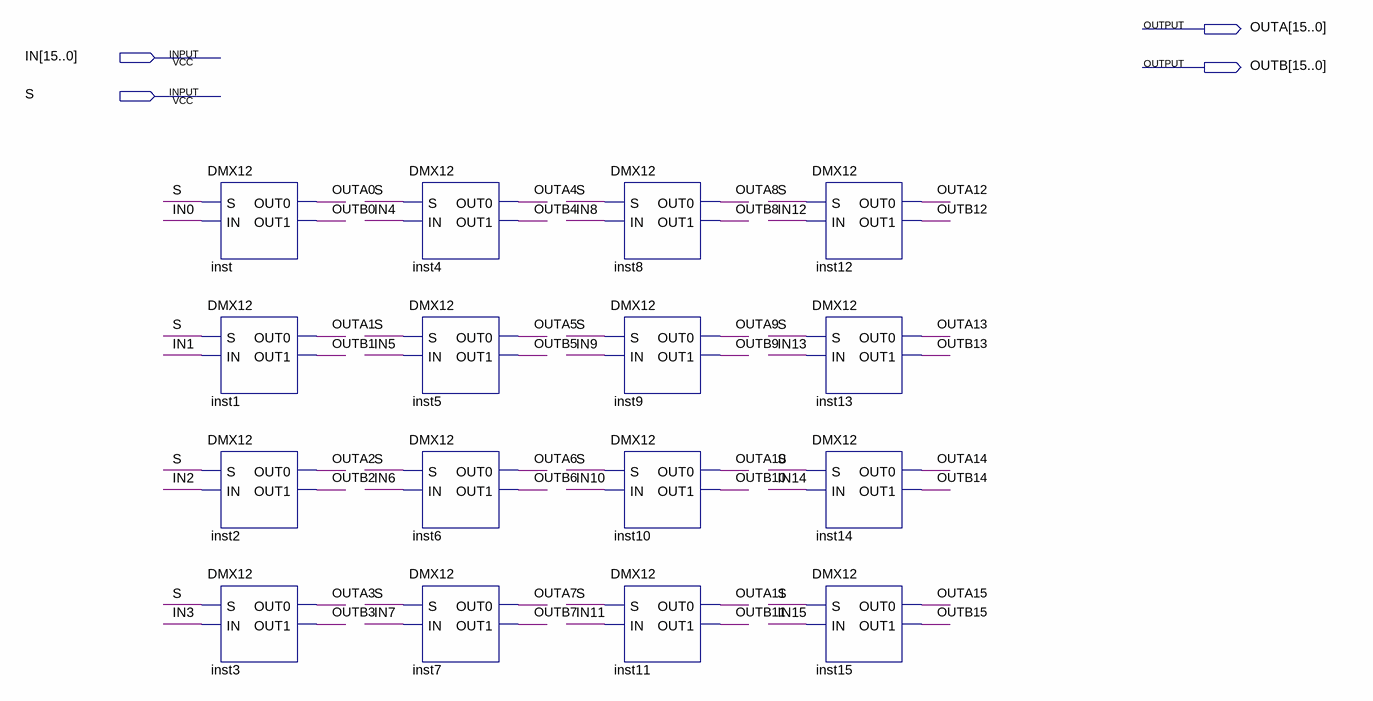
[diagram p0: schematic sheet]
// Quartus schematic DMX16.bdf as structural Verilog: 16 symbols, 4 pins
module DMX16 (
  input  [15:0] IN,
  input  S,
  output [15:0] OUTA,
  output [15:0] OUTB
);

  DMX12 inst (.S(S), .IN(IN[0]), .OUT0(OUTA[0]), .OUT1(OUTB[0]));
  DMX12 inst1 (.S(S), .IN(IN[1]), .OUT0(OUTA[1]), .OUT1(OUTB[1]));
  DMX12 inst2 (.S(S), .IN(IN[2]), .OUT0(OUTA[2]), .OUT1(OUTB[2]));
  DMX12 inst3 (.S(S), .IN(IN[3]), .OUT0(OUTA[3]), .OUT1(OUTB[3]));
  DMX12 inst4 (.S(S), .IN(IN[4]), .OUT0(OUTA[4]), .OUT1(OUTB[4]));
  DMX12 inst5 (.S(S), .IN(IN[5]), .OUT0(OUTA[5]), .OUT1(OUTB[5]));
  DMX12 inst6 (.S(S), .IN(IN[6]), .OUT0(OUTA[6]), .OUT1(OUTB[6]));
  DMX12 inst7 (.S(S), .IN(IN[7]), .OUT0(OUTA[7]), .OUT1(OUTB[7]));
  DMX12 inst8 (.S(S), .IN(IN[8]), .OUT0(OUTA[8]), .OUT1(OUTB[8]));
  DMX12 inst9 (.S(S), .IN(IN[9]), .OUT0(OUTA[9]), .OUT1(OUTB[9]));
  DMX12 inst10 (.S(S), .IN(IN[10]), .OUT0(OUTA[10]), .OUT1(OUTB[10]));
  DMX12 inst11 (.S(S), .IN(IN[11]), .OUT0(OUTA[11]), .OUT1(OUTB[11]));
  DMX12 inst12 (.S(S), .IN(IN[12]), .OUT0(OUTA[12]), .OUT1(OUTB[12]));
  DMX12 inst13 (.S(S), .IN(IN[13]), .OUT0(OUTA[13]), .OUT1(OUTB[13]));
  DMX12 inst14 (.S(S), .IN(IN[14]), .OUT0(OUTA[14]), .OUT1(OUTB[14]));
  DMX12 inst15 (.S(S), .IN(IN[15]), .OUT0(OUTA[15]), .OUT1(OUTB[15]));
endmodule
